# Altium schematic sheet 4-DDR3_MEMORY.SchDoc
size 558 x 431 mm
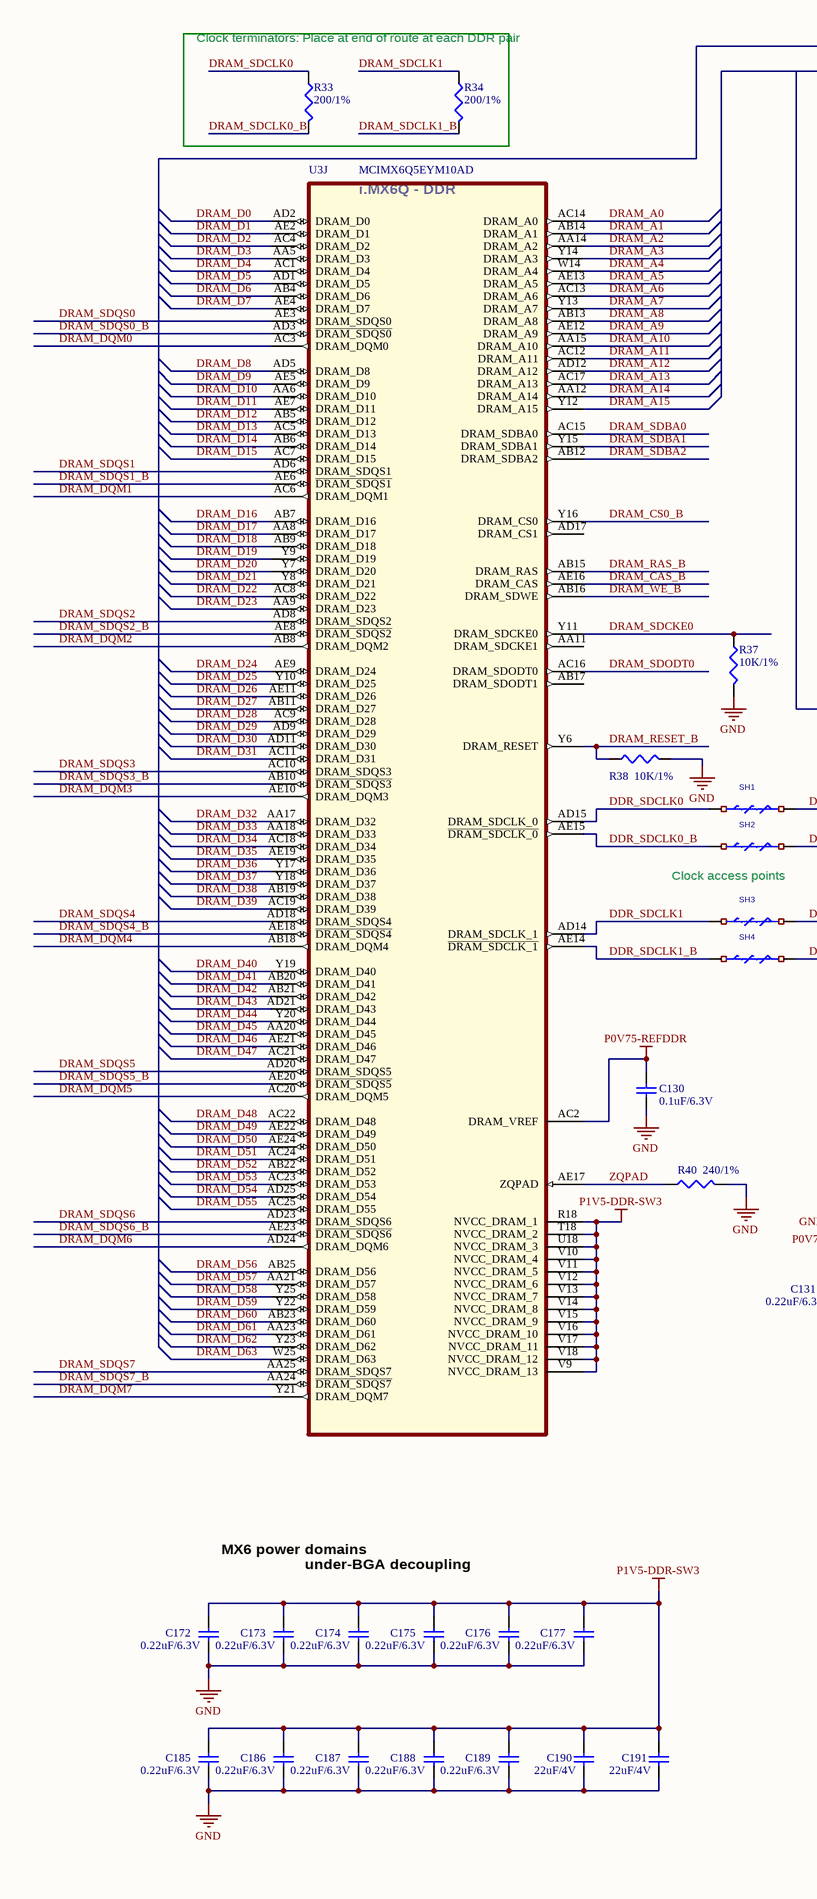
[diagram p0: 4-DDR3_MEMORY.SchDoc, left]
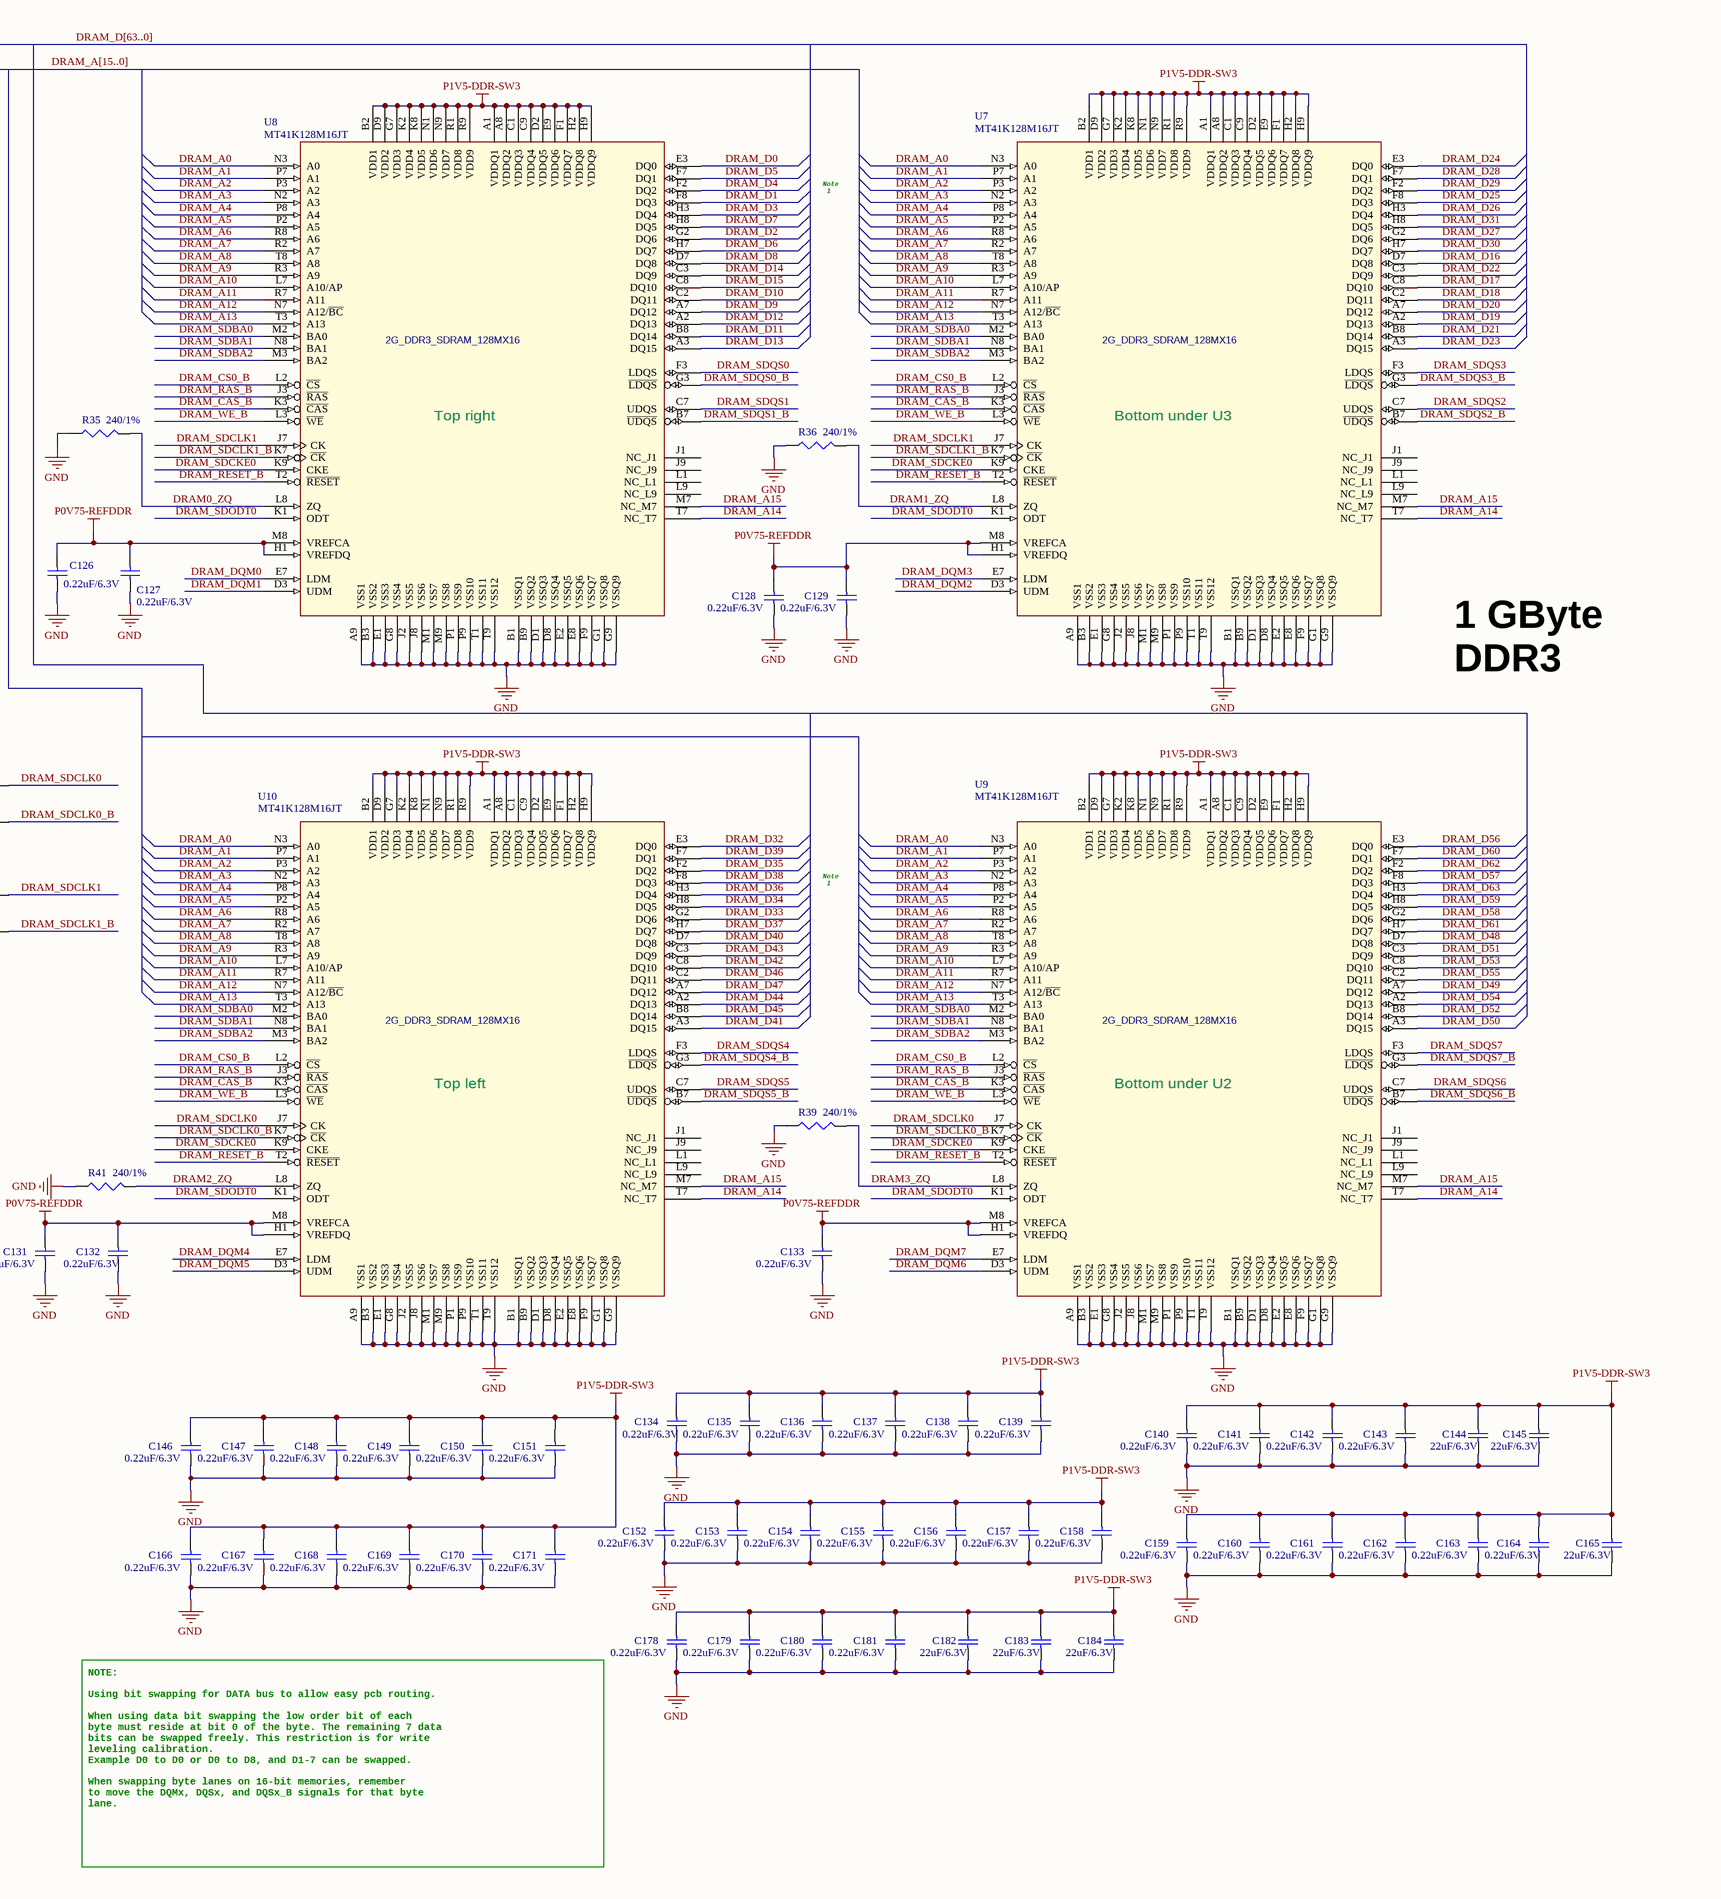
[diagram p1: 4-DDR3_MEMORY.SchDoc, right]

## Parts
C126  0.22uF/6.3V  [0402_CC]
C127  0.22uF/6.3V  [0402_CC]
C128  0.22uF/6.3V  [0402_CC]
C129  0.22uF/6.3V  [0402_CC]
C130  0.1uF/6.3V  [0402_CC]
C131  0.22uF/6.3V  [0402_CC]
C132  0.22uF/6.3V  [0402_CC]
C133  0.22uF/6.3V  [0402_CC]
C134  0.22uF/6.3V  [0402_CC]
C135  0.22uF/6.3V  [0402_CC]
C136  0.22uF/6.3V  [0402_CC]
C137  0.22uF/6.3V  [0402_CC]
C138  0.22uF/6.3V  [0402_CC]
C139  0.22uF/6.3V  [0402_CC]
C140  0.22uF/6.3V  [0402_CC]
C141  0.22uF/6.3V  [0402_CC]
C142  0.22uF/6.3V  [0402_CC]
C143  0.22uF/6.3V  [0402_CC]
C144  22uF/6.3V  [0805_CC]
C145  22uF/6.3V  [0805_CC]
C146  0.22uF/6.3V  [0402_CC]
C147  0.22uF/6.3V  [0402_CC]
C148  0.22uF/6.3V  [0402_CC]
C149  0.22uF/6.3V  [0402_CC]
C150  0.22uF/6.3V  [0402_CC]
C151  0.22uF/6.3V  [0402_CC]
C152  0.22uF/6.3V  [0402_CC]
C153  0.22uF/6.3V  [0402_CC]
C154  0.22uF/6.3V  [0402_CC]
C155  0.22uF/6.3V  [0402_CC]
C156  0.22uF/6.3V  [0402_CC]
C157  0.22uF/6.3V  [0402_CC]
C158  0.22uF/6.3V  [0402_CC]
C159  0.22uF/6.3V  [0402_CC]
C160  0.22uF/6.3V  [0402_CC]
C161  0.22uF/6.3V  [0402_CC]
C162  0.22uF/6.3V  [0402_CC]
C163  0.22uF/6.3V  [0402_CC]
C164  0.22uF/6.3V  [0402_CC]
C165  22uF/6.3V  [0805_CC]
C166  0.22uF/6.3V  [0402_CC]
C167  0.22uF/6.3V  [0402_CC]
C168  0.22uF/6.3V  [0402_CC]
C169  0.22uF/6.3V  [0402_CC]
C170  0.22uF/6.3V  [0402_CC]
C171  0.22uF/6.3V  [0402_CC]
C172  0.22uF/6.3V  [0201_CC]
C173  0.22uF/6.3V  [0201_CC]
C174  0.22uF/6.3V  [0201_CC]
C175  0.22uF/6.3V  [0201_CC]
C176  0.22uF/6.3V  [0201_CC]
C177  0.22uF/6.3V  [0201_CC]
C178  0.22uF/6.3V  [0402_CC]
C179  0.22uF/6.3V  [0402_CC]
C180  0.22uF/6.3V  [0402_CC]
C181  0.22uF/6.3V  [0402_CC]
C182  22uF/6.3V  [0805_CC]
C183  22uF/6.3V  [0805_CC]
C184  22uF/6.3V  [0805_CC]
C185  0.22uF/6.3V  [0201_CC]
C186  0.22uF/6.3V  [0201_CC]
C187  0.22uF/6.3V  [0201_CC]
C188  0.22uF/6.3V  [0201_CC]
C189  0.22uF/6.3V  [0201_CC]
C190  22uF/4V  [0603_CC]
C191  22uF/4V  [0603_CC]
R33  200/1%  [0402_CC]
R34  200/1%  [0402_CC]
R35  240/1%  [0402_CC]
R36  240/1%  [0402_CC]
R37  10K/1%  [0402_CC]
R38  10K/1%  [0402_CC]
R39  240/1%  [0402_CC]
R40  240/1%  [0402_CC]
R41  240/1%  [0402_CC]
SH1  0  [0201_CC]  (value not drawn)
SH2  0  [0201_CC]  (value not drawn)
SH3  0  [0201_CC]  (value not drawn)
SH4  0  [0201_CC]  (value not drawn)
U3  MCIMX6Q5EYM10AD  [FCPBGA]  (part J of 12)
U7  MT41K128M16JT  [BGA96]
U8  MT41K128M16JT  [BGA96]
U9  MT41K128M16JT  [BGA96]
U10  MT41K128M16JT  [BGA96]

## Blocks framed on the sheet
Clock terminators: Place at end of route at each DDR pair: R33 R34

## Nets
GND: C126.2 C127.2 C128.2 C129.2 C130.2 C131.2 C132.2 C133.2 C134.2 C135.2 C136.2 C137.2 C138.2 C139.2 C140.2 C141.2 C142.2 C143.2 C144.2 C145.2 C146.2 C147.2 C148.2 C149.2 C150.2 C151.2 C152.2 C153.2 C154.2 C155.2 C156.2 C157.2 C158.2 C159.2 C160.2 C161.2 C162.2 C163.2 C164.2 C165.2 C166.2 C167.2 C168.2 C169.2 C170.2 C171.2 C172.2 C173.2 C174.2 C175.2 C176.2 C177.2 C178.2 C179.2 C180.2 C181.2 C182.2 C183.2 C184.2 C185.2 C186.2 C187.2 C188.2 C189.2 C190.2 C191.2 R35.1 R36.1 R37.2 R38.2 R39.1 R40.2 R41.1 U7.A9(VSS1) U7.B1(VSSQ1) U7.B3(VSS2) U7.B9(VSSQ2) U7.D1(VSSQ3) U7.D8(VSSQ4) U7.E1(VSS3) U7.E2(VSSQ5) U7.E8(VSSQ6) U7.F9(VSSQ7) U7.G1(VSSQ8) U7.G8(VSS4) U7.G9(VSSQ9) U7.J2(VSS5) U7.J8(VSS6) U7.M1(VSS7) U7.M9(VSS8) U7.P1(VSS9) U7.P9(VSS10) U7.T1(VSS11) U7.T9(VSS12) U8.A9(VSS1) U8.B1(VSSQ1) U8.B3(VSS2) U8.B9(VSSQ2) U8.D1(VSSQ3) U8.D8(VSSQ4) U8.E1(VSS3) U8.E2(VSSQ5) U8.E8(VSSQ6) U8.F9(VSSQ7) U8.G1(VSSQ8) U8.G8(VSS4) U8.G9(VSSQ9) U8.J2(VSS5) U8.J8(VSS6) U8.M1(VSS7) U8.M9(VSS8) U8.P1(VSS9) U8.P9(VSS10) U8.T1(VSS11) U8.T9(VSS12) U9.A9(VSS1) U9.B1(VSSQ1) U9.B3(VSS2) U9.B9(VSSQ2) U9.D1(VSSQ3) U9.D8(VSSQ4) U9.E1(VSS3) U9.E2(VSSQ5) U9.E8(VSSQ6) U9.F9(VSSQ7) U9.G1(VSSQ8) U9.G8(VSS4) U9.G9(VSSQ9) U9.J2(VSS5) U9.J8(VSS6) U9.M1(VSS7) U9.M9(VSS8) U9.P1(VSS9) U9.P9(VSS10) U9.T1(VSS11) U9.T9(VSS12) U10.A9(VSS1) U10.B1(VSSQ1) U10.B3(VSS2) U10.B9(VSSQ2) U10.D1(VSSQ3) U10.D8(VSSQ4) U10.E1(VSS3) U10.E2(VSSQ5) U10.E8(VSSQ6) U10.F9(VSSQ7) U10.G1(VSSQ8) U10.G8(VSS4) U10.G9(VSSQ9) U10.J2(VSS5) U10.J8(VSS6) U10.M1(VSS7) U10.M9(VSS8) U10.P1(VSS9) U10.P9(VSS10) U10.T1(VSS11) U10.T9(VSS12)
P0V75-REFDDR: C126.1 C127.1 C128.1 C129.1 C130.1 C131.1 C132.1 C133.1 U3.AC2(DRAM_VREF) U7.H1(VREFDQ) U7.M8(VREFCA) U8.H1(VREFDQ) U8.M8(VREFCA) U9.H1(VREFDQ) U9.M8(VREFCA) U10.H1(VREFDQ) U10.M8(VREFCA)
P1V5-DDR-SW3: C134.1 C135.1 C136.1 C137.1 C138.1 C139.1 C140.1 C141.1 C142.1 C143.1 C144.1 C145.1 C146.1 C147.1 C148.1 C149.1 C150.1 C151.1 C152.1 C153.1 C154.1 C155.1 C156.1 C157.1 C158.1 C159.1 C160.1 C161.1 C162.1 C163.1 C164.1 C165.1 C166.1 C167.1 C168.1 C169.1 C170.1 C171.1 C172.1 C173.1 C174.1 C175.1 C176.1 C177.1 C178.1 C179.1 C180.1 C181.1 C182.1 C183.1 C184.1 C185.1 C186.1 C187.1 C188.1 C189.1 C190.1 C191.1 U3.R18(NVCC_DRAM_1) U3.T18(NVCC_DRAM_2) U3.U18(NVCC_DRAM_3) U3.V9(NVCC_DRAM_13) U3.V10(NVCC_DRAM_4) U3.V11(NVCC_DRAM_5) U3.V12(NVCC_DRAM_6) U3.V13(NVCC_DRAM_7) U3.V14(NVCC_DRAM_8) U3.V15(NVCC_DRAM_9) U3.V16(NVCC_DRAM_10) U3.V17(NVCC_DRAM_11) U3.V18(NVCC_DRAM_12) U7.A1(VDDQ1) U7.A8(VDDQ2) U7.B2(VDD1) U7.C1(VDDQ3) U7.C9(VDDQ4) U7.D2(VDDQ5) U7.D9(VDD2) U7.E9(VDDQ6) U7.F1(VDDQ7) U7.G7(VDD3) U7.H2(VDDQ8) U7.H9(VDDQ9) U7.K2(VDD4) U7.K8(VDD5) U7.N1(VDD6) U7.N9(VDD7) U7.R1(VDD8) U7.R9(VDD9) U8.A1(VDDQ1) U8.A8(VDDQ2) U8.B2(VDD1) U8.C1(VDDQ3) U8.C9(VDDQ4) U8.D2(VDDQ5) U8.D9(VDD2) U8.E9(VDDQ6) U8.F1(VDDQ7) U8.G7(VDD3) U8.H2(VDDQ8) U8.H9(VDDQ9) U8.K2(VDD4) U8.K8(VDD5) U8.N1(VDD6) U8.N9(VDD7) U8.R1(VDD8) U8.R9(VDD9) U9.A1(VDDQ1) U9.A8(VDDQ2) U9.B2(VDD1) U9.C1(VDDQ3) U9.C9(VDDQ4) U9.D2(VDDQ5) U9.D9(VDD2) U9.E9(VDDQ6) U9.F1(VDDQ7) U9.G7(VDD3) U9.H2(VDDQ8) U9.H9(VDDQ9) U9.K2(VDD4) U9.K8(VDD5) U9.N1(VDD6) U9.N9(VDD7) U9.R1(VDD8) U9.R9(VDD9) U10.A1(VDDQ1) U10.A8(VDDQ2) U10.B2(VDD1) U10.C1(VDDQ3) U10.C9(VDDQ4) U10.D2(VDDQ5) U10.D9(VDD2) U10.E9(VDDQ6) U10.F1(VDDQ7) U10.G7(VDD3) U10.H2(VDDQ8) U10.H9(VDDQ9) U10.K2(VDD4) U10.K8(VDD5) U10.N1(VDD6) U10.N9(VDD7) U10.R1(VDD8) U10.R9(VDD9)
DDR_SDCLK0: SH1.1 U3.AD15(DRAM_SDCLK_0)
DDR_SDCLK0_B: SH2.1 U3.AE15(~{DRAM_SDCLK_0})
DDR_SDCLK1: SH3.1 U3.AD14(DRAM_SDCLK_1)
DDR_SDCLK1_B: SH4.1 U3.AE14(~{DRAM_SDCLK_1})
DRAM0_ZQ: R35.2 U8.L8(ZQ)
DRAM1_ZQ: R36.2 U7.L8(ZQ)
DRAM2_ZQ: R41.2 U10.L8(ZQ)
DRAM3_ZQ: R39.2 U9.L8(ZQ)
DRAM_A0: U3.AC14(DRAM_A0) U7.N3(A0) U8.N3(A0) U9.N3(A0) U10.N3(A0)
DRAM_A1: U3.AB14(DRAM_A1) U7.P7(A1) U8.P7(A1) U9.P7(A1) U10.P7(A1)
DRAM_A2: U3.AA14(DRAM_A2) U7.P3(A2) U8.P3(A2) U9.P3(A2) U10.P3(A2)
DRAM_A3: U3.Y14(DRAM_A3) U7.N2(A3) U8.N2(A3) U9.N2(A3) U10.N2(A3)
DRAM_A4: U3.W14(DRAM_A4) U7.P8(A4) U8.P8(A4) U9.P8(A4) U10.P8(A4)
DRAM_A5: U3.AE13(DRAM_A5) U7.P2(A5) U8.P2(A5) U9.P2(A5) U10.P2(A5)
DRAM_A6: U3.AC13(DRAM_A6) U7.R8(A6) U8.R8(A6) U9.R8(A6) U10.R8(A6)
DRAM_A7: U3.Y13(DRAM_A7) U7.R2(A7) U8.R2(A7) U9.R2(A7) U10.R2(A7)
DRAM_A8: U3.AB13(DRAM_A8) U7.T8(A8) U8.T8(A8) U9.T8(A8) U10.T8(A8)
DRAM_A9: U3.AE12(DRAM_A9) U7.R3(A9) U8.R3(A9) U9.R3(A9) U10.R3(A9)
DRAM_A10: U3.AA15(DRAM_A10) U7.L7(A10/AP) U8.L7(A10/AP) U9.L7(A10/AP) U10.L7(A10/AP)
DRAM_A11: U3.AC12(DRAM_A11) U7.R7(A11) U8.R7(A11) U9.R7(A11) U10.R7(A11)
DRAM_A12: U3.AD12(DRAM_A12) U7.N7(A12/~{BC}) U8.N7(A12/~{BC}) U9.N7(A12/~{BC}) U10.N7(A12/~{BC})
DRAM_A13: U3.AC17(DRAM_A13) U7.T3(A13) U8.T3(A13) U9.T3(A13) U10.T3(A13)
DRAM_A14: U3.AA12(DRAM_A14) U7.T7(NC_T7) U8.T7(NC_T7) U9.T7(NC_T7) U10.T7(NC_T7)
DRAM_A15: U3.Y12(DRAM_A15) U7.M7(NC_M7) U8.M7(NC_M7) U9.M7(NC_M7) U10.M7(NC_M7)
DRAM_CAS_B: U3.AE16(DRAM_CAS) U7.K3(~{CAS}) U8.K3(~{CAS}) U9.K3(~{CAS}) U10.K3(~{CAS})
DRAM_CS0_B: U3.Y16(DRAM_CS0) U7.L2(~{CS}) U8.L2(~{CS}) U9.L2(~{CS}) U10.L2(~{CS})
DRAM_D0: U3.AD2(DRAM_D0) U8.E3(DQ0)
DRAM_D1: U3.AE2(DRAM_D1) U8.F8(DQ3)
DRAM_D2: U3.AC4(DRAM_D2) U8.G2(DQ6)
DRAM_D3: U3.AA5(DRAM_D3) U8.H3(DQ4)
DRAM_D4: U3.AC1(DRAM_D4) U8.F2(DQ2)
DRAM_D5: U3.AD1(DRAM_D5) U8.F7(DQ1)
DRAM_D6: U3.AB4(DRAM_D6) U8.H7(DQ7)
DRAM_D7: U3.AE4(DRAM_D7) U8.H8(DQ5)
DRAM_D8: U3.AD5(DRAM_D8) U8.D7(DQ8)
DRAM_D9: U3.AE5(DRAM_D9) U8.A7(DQ12)
DRAM_D10: U3.AA6(DRAM_D10) U8.C2(DQ11)
DRAM_D11: U3.AE7(DRAM_D11) U8.B8(DQ14)
DRAM_D12: U3.AB5(DRAM_D12) U8.A2(DQ13)
DRAM_D13: U3.AC5(DRAM_D13) U8.A3(DQ15)
DRAM_D14: U3.AB6(DRAM_D14) U8.C3(DQ9)
DRAM_D15: U3.AC7(DRAM_D15) U8.C8(DQ10)
DRAM_D16: U3.AB7(DRAM_D16) U7.D7(DQ8)
DRAM_D17: U3.AA8(DRAM_D17) U7.C8(DQ10)
DRAM_D18: U3.AB9(DRAM_D18) U7.C2(DQ11)
DRAM_D19: U3.Y9(DRAM_D19) U7.A2(DQ13)
DRAM_D20: U3.Y7(DRAM_D20) U7.A7(DQ12)
DRAM_D21: U3.Y8(DRAM_D21) U7.B8(DQ14)
DRAM_D22: U3.AC8(DRAM_D22) U7.C3(DQ9)
DRAM_D23: U3.AA9(DRAM_D23) U7.A3(DQ15)
DRAM_D24: U3.AE9(DRAM_D24) U7.E3(DQ0)
DRAM_D25: U3.Y10(DRAM_D25) U7.F8(DQ3)
DRAM_D26: U3.AE11(DRAM_D26) U7.H3(DQ4)
DRAM_D27: U3.AB11(DRAM_D27) U7.G2(DQ6)
DRAM_D28: U3.AC9(DRAM_D28) U7.F7(DQ1)
DRAM_D29: U3.AD9(DRAM_D29) U7.F2(DQ2)
DRAM_D30: U3.AD11(DRAM_D30) U7.H7(DQ7)
DRAM_D31: U3.AC11(DRAM_D31) U7.H8(DQ5)
DRAM_D32: U3.AA17(DRAM_D32) U10.E3(DQ0)
DRAM_D33: U3.AA18(DRAM_D33) U10.G2(DQ6)
DRAM_D34: U3.AC18(DRAM_D34) U10.H8(DQ5)
DRAM_D35: U3.AE19(DRAM_D35) U10.F2(DQ2)
DRAM_D36: U3.Y17(DRAM_D36) U10.H3(DQ4)
DRAM_D37: U3.Y18(DRAM_D37) U10.H7(DQ7)
DRAM_D38: U3.AB19(DRAM_D38) U10.F8(DQ3)
DRAM_D39: U3.AC19(DRAM_D39) U10.F7(DQ1)
DRAM_D40: U3.Y19(DRAM_D40) U10.D7(DQ8)
DRAM_D41: U3.AB20(DRAM_D41) U10.A3(DQ15)
DRAM_D42: U3.AB21(DRAM_D42) U10.C8(DQ10)
DRAM_D43: U3.AD21(DRAM_D43) U10.C3(DQ9)
DRAM_D44: U3.Y20(DRAM_D44) U10.A2(DQ13)
DRAM_D45: U3.AA20(DRAM_D45) U10.B8(DQ14)
DRAM_D46: U3.AE21(DRAM_D46) U10.C2(DQ11)
DRAM_D47: U3.AC21(DRAM_D47) U10.A7(DQ12)
DRAM_D48: U3.AC22(DRAM_D48) U9.D7(DQ8)
DRAM_D49: U3.AE22(DRAM_D49) U9.A7(DQ12)
DRAM_D50: U3.AE24(DRAM_D50) U9.A3(DQ15)
DRAM_D51: U3.AC24(DRAM_D51) U9.C3(DQ9)
DRAM_D52: U3.AB22(DRAM_D52) U9.B8(DQ14)
DRAM_D53: U3.AC23(DRAM_D53) U9.C8(DQ10)
DRAM_D54: U3.AD25(DRAM_D54) U9.A2(DQ13)
DRAM_D55: U3.AC25(DRAM_D55) U9.C2(DQ11)
DRAM_D56: U3.AB25(DRAM_D56) U9.E3(DQ0)
DRAM_D57: U3.AA21(DRAM_D57) U9.F8(DQ3)
DRAM_D58: U3.Y25(DRAM_D58) U9.G2(DQ6)
DRAM_D59: U3.Y22(DRAM_D59) U9.H8(DQ5)
DRAM_D60: U3.AB23(DRAM_D60) U9.F7(DQ1)
DRAM_D61: U3.AA23(DRAM_D61) U9.H7(DQ7)
DRAM_D62: U3.Y23(DRAM_D62) U9.F2(DQ2)
DRAM_D63: U3.W25(DRAM_D63) U9.H3(DQ4)
DRAM_DQM0: U3.AC3(DRAM_DQM0) U8.E7(LDM)
DRAM_DQM1: U3.AC6(DRAM_DQM1) U8.D3(UDM)
DRAM_DQM2: U3.AB8(DRAM_DQM2) U7.D3(UDM)
DRAM_DQM3: U3.AE10(DRAM_DQM3) U7.E7(LDM)
DRAM_DQM4: U3.AB18(DRAM_DQM4) U10.E7(LDM)
DRAM_DQM5: U3.AC20(DRAM_DQM5) U10.D3(UDM)
DRAM_DQM6: U3.AD24(DRAM_DQM6) U9.D3(UDM)
DRAM_DQM7: U3.Y21(DRAM_DQM7) U9.E7(LDM)
DRAM_RAS_B: U3.AB15(DRAM_RAS) U7.J3(~{RAS}) U8.J3(~{RAS}) U9.J3(~{RAS}) U10.J3(~{RAS})
DRAM_RESET_B: R38.1 U3.Y6(DRAM_RESET) U7.T2(~{RESET}) U8.T2(~{RESET}) U9.T2(~{RESET}) U10.T2(~{RESET})
DRAM_SDBA0: U3.AC15(DRAM_SDBA0) U7.M2(BA0) U8.M2(BA0) U9.M2(BA0) U10.M2(BA0)
DRAM_SDBA1: U3.Y15(DRAM_SDBA1) U7.N8(BA1) U8.N8(BA1) U9.N8(BA1) U10.N8(BA1)
DRAM_SDBA2: U3.AB12(DRAM_SDBA2) U7.M3(BA2) U8.M3(BA2) U9.M3(BA2) U10.M3(BA2)
DRAM_SDCKE0: R37.1 U3.Y11(DRAM_SDCKE0) U7.K9(CKE) U8.K9(CKE) U9.K9(CKE) U10.K9(CKE)
DRAM_SDCLK0: R33.1 SH1.2 U9.J7(CK) U10.J7(CK)
DRAM_SDCLK0_B: R33.2 SH2.2 U9.K7(~{CK}) U10.K7(~{CK})
DRAM_SDCLK1: R34.1 SH3.2 U7.J7(CK) U8.J7(CK)
DRAM_SDCLK1_B: R34.2 SH4.2 U7.K7(~{CK}) U8.K7(~{CK})
DRAM_SDODT0: U3.AC16(DRAM_SDODT0) U7.K1(ODT) U8.K1(ODT) U9.K1(ODT) U10.K1(ODT)
DRAM_SDQS0: U3.AE3(DRAM_SDQS0) U8.F3(LDQS)
DRAM_SDQS0_B: U3.AD3(~{DRAM_SDQS0}) U8.G3(~{LDQS})
DRAM_SDQS1: U3.AD6(DRAM_SDQS1) U8.C7(UDQS)
DRAM_SDQS1_B: U3.AE6(~{DRAM_SDQS1}) U8.B7(~{UDQS})
DRAM_SDQS2: U3.AD8(DRAM_SDQS2) U7.C7(UDQS)
DRAM_SDQS2_B: U3.AE8(~{DRAM_SDQS2}) U7.B7(~{UDQS})
DRAM_SDQS3: U3.AC10(DRAM_SDQS3) U7.F3(LDQS)
DRAM_SDQS3_B: U3.AB10(~{DRAM_SDQS3}) U7.G3(~{LDQS})
DRAM_SDQS4: U3.AD18(DRAM_SDQS4) U10.F3(LDQS)
DRAM_SDQS4_B: U3.AE18(~{DRAM_SDQS4}) U10.G3(~{LDQS})
DRAM_SDQS5: U3.AD20(DRAM_SDQS5) U10.C7(UDQS)
DRAM_SDQS5_B: U3.AE20(~{DRAM_SDQS5}) U10.B7(~{UDQS})
DRAM_SDQS6: U3.AD23(DRAM_SDQS6) U9.C7(UDQS)
DRAM_SDQS6_B: U3.AE23(~{DRAM_SDQS6}) U9.B7(~{UDQS})
DRAM_SDQS7: U3.AA25(DRAM_SDQS7) U9.F3(LDQS)
DRAM_SDQS7_B: U3.AA24(~{DRAM_SDQS7}) U9.G3(~{LDQS})
DRAM_WE_B: U3.AB16(DRAM_SDWE) U7.L3(~{WE}) U8.L3(~{WE}) U9.L3(~{WE}) U10.L3(~{WE})
ZQPAD: R40.1 U3.AE17(ZQPAD)

Not connected (* = marked no-connect by the designer): U3 AA11(DRAM_SDCKE1) AB17(DRAM_SDODT1) AD17(DRAM_CS1); U7 J1(NC_J1) J9(NC_J9) L1(NC_L1) L9(NC_L9); U8 J1(NC_J1) J9(NC_J9) L1(NC_L1) L9(NC_L9); U9 J1(NC_J1) J9(NC_J9) L1(NC_L1) L9(NC_L9); U10 J1(NC_J1) J9(NC_J9) L1(NC_L1) L9(NC_L9)

## Buses and harness runs
bus DRAM_A[15..0]
bus DRAM_D[63..0]

## Notes on the sheet
- Note
  1
- (near U8) Top right
- (near U7) Bottom under U3
- 1 GByte
  DDR3
- Clock access points
- (near U10) Top left
- (near U9) Bottom under U2
- MX6 power domains
  under-BGA decoupling
- NOTE:
  Using bit swapping for DATA bus to allow easy pcb routing.
  When using data bit swapping the low order bit of each
  byte must reside at bit 0 of the byte. The remaining 7 data
  bits can be swapped freely. This restriction is for write
  leveling calibration.
  Example D0 to D0 or D0 to D8, and D1-7 can be swapped.
  When swapping byte lanes on 16-bit memories, remember
  to move the DQMx, DQSx, and DQSx_B signals for that byte
  lane.
- (in symbol 2G_DDR3_SDRAM_128MX16_96P) 2G_DDR3_SDRAM_128MX16
- (in symbol PCIMX6Q6VV1A, part J) i.MX6Q - DDR

## Library data of the parts
C126-C191 = Cap: Capacitor; Published: 8-Jun-2000; LatestRevisionDate: 17-Jul-2002; LatestRevisionNote: Re-released for DXP Platform.; PackageReference: RAD-0.3; Publisher: Altium Limited; PackageDescription: Radial Cap, Thru-Hole; 2 Leads; 0.3 in Pin Spacing
R33-R41 = Res3: Resistor; Published: 8-Jun-2000; LatestRevisionDate: 29-May-2009; LatestRevisionNote: IPC-7351 Footprint Added.; PackageReference: J1-0603; Publisher: Altium Limited; PackageDescription: Chip Resistor
SH1-SH4 = RES_SHORT-2: ZERO OHM CUT TRACE 0201 PADS; NO PART TO ORDER; CLASS: DISCRETE; AGILE_PN: 470-76473; MFG_NAME01: LAYOUT ELEMENT ONLY; ASSY_OPT: DNP; CAD_APPROVED: Yes; FPLIST: SH0201,SH0201_CC; MFG_PN01: LAYOUT ELEMENT ONLY; ROHS: Yes
U3 = PCIMX6Q6VV1A: IC MCU MX6QUAD ARM CORTEX-A9 FCPBGA624; CAD_APPROVED: Yes; MFG_PN01: MCIMX6Q6AVT10AC; MFG_NAME01: FREESCALE SEMICONDUCTOR; AGILE_PN: 344-01218; CLASS: IC; HEIGHT: 2.16MM; ROHS: Yes
U7 = 2G_DDR3_SDRAM_128MX16_96P: IC MEM DDR3 SDRAM 2Gb 128MX16 1.35V FBGA96; AGILE_PN: 334-77489; MFG_NAME01: MICRON; MFG_PN01: MT41K128M16JT-125:K; CAD_APPROVED: Yes; CLASS: IC; ROHS: Yes; HEIGHT: 1.2 MM
U8-U10 = 2G_DDR3_SDRAM_128MX16_96P: IC MEM DDR3 SDRAM 2Gb 128MX16 1.35V FBGA96; CAD_APPROVED: Yes; MFG_PN01: MT41K128M16JT-125:K; MFG_NAME01: MICRON; AGILE_PN: 334-77489; CLASS: IC; HEIGHT: 1.2 MM; ROHS: Yes